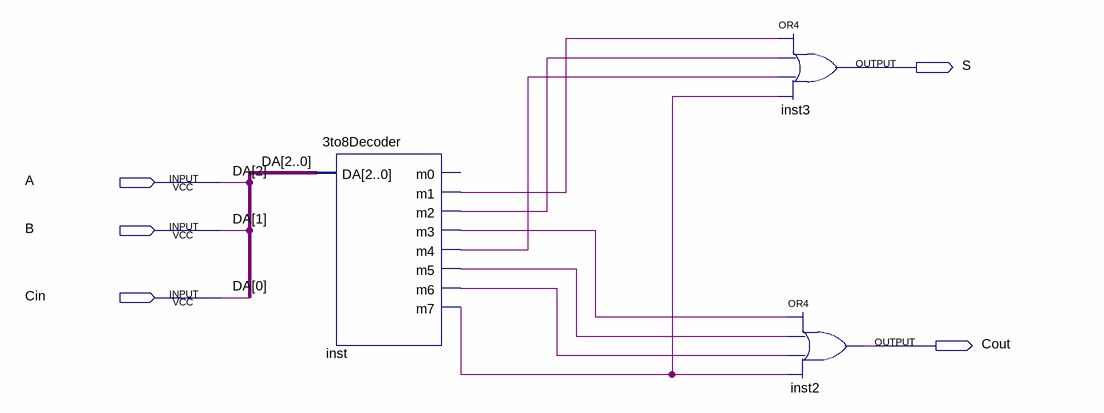
[diagram p0: schematic sheet]
// Quartus schematic FullAdder.bdf as structural Verilog: 3 symbols, 5 pins
module FullAdder (
  input  A,
  input  B,
  input  Cin,
  output S,
  output Cout
);

  wire inst_m1, inst_m2, inst_m3, inst_m4, inst_m5, inst_m6, inst_m7;

  \3to8Decoder  inst (
    .DA({A, B, Cin}), .m1(inst_m1), .m2(inst_m2), .m3(inst_m3), .m4(inst_m4), .m5(inst_m5), .m6(inst_m6),
    .m7(inst_m7));  // open: m0
  or inst3 (S, inst_m1, inst_m2, inst_m4, inst_m7);
  or inst2 (Cout, inst_m3, inst_m5, inst_m6, inst_m7);

  // Other names for the same wires on the sheet: DA[2:0] = {A, B, Cin}
endmodule
